# EAGLE design ear-o_devboard (EAGLE 8.4.3)
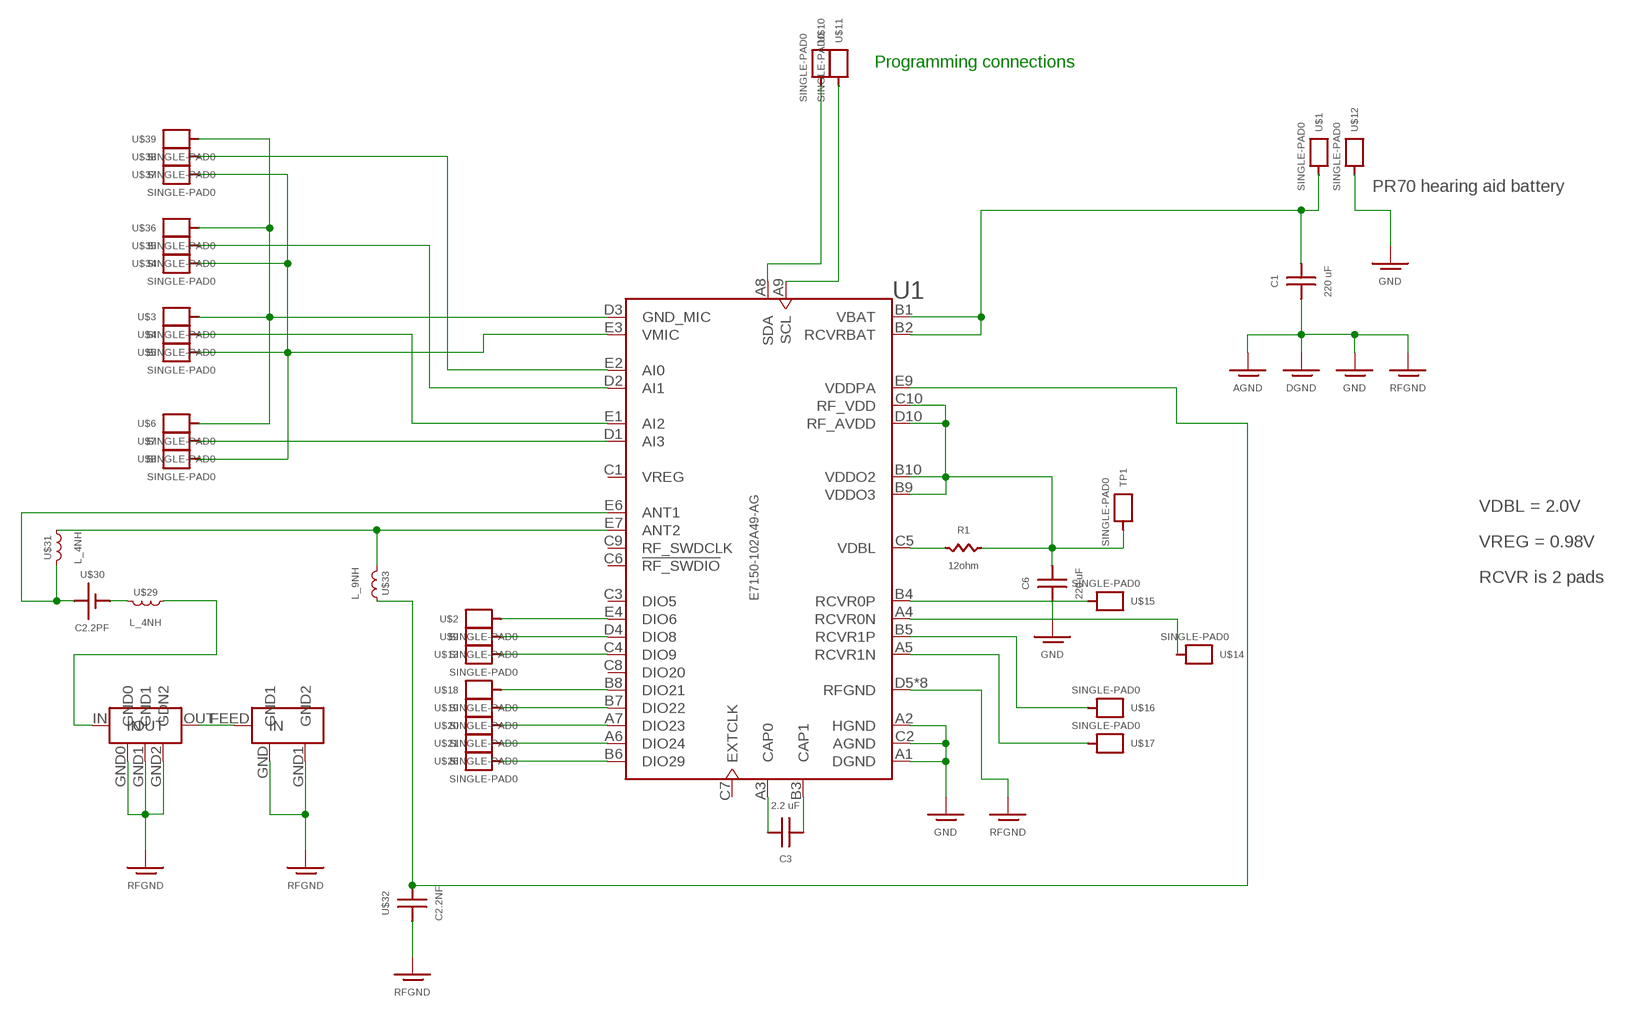
[diagram p0: schematic, sheet 1]

## Parts
C1  220 uF  C220UF  [1206]
C3  2.2 uF  C2.2UF  [0201]
C6  220 uF  C220UF  [1206]
R1  12ohm  R12OHM  [0201]
TP1  SINGLE-PAD0  [TH]
U1  E7150-102A49-AG  [BGA49C69P10X5_739X394X178]
U$1  SINGLE-PAD0  [TH]
U$2  SINGLE-PAD0  [TH]
U$3  SINGLE-PAD0  [TH]
U$4  SINGLE-PAD0  [TH]
U$5  SINGLE-PAD0  [TH]
U$6  SINGLE-PAD0  [TH]
U$7  SINGLE-PAD0  [TH]
U$8  SINGLE-PAD0  [TH]
U$9  SINGLE-PAD0  [TH]
U$10  SINGLE-PAD0  [TH]
U$11  SINGLE-PAD0  [TH]
U$12  SINGLE-PAD0  [TH]
U$13  SINGLE-PAD0  [TH]
U$14  SINGLE-PAD0  [TH]
U$15  SINGLE-PAD0  [TH]
U$16  SINGLE-PAD0  [TH]
U$17  SINGLE-PAD0  [TH]
U$18  SINGLE-PAD0  [TH]
U$19  SINGLE-PAD0  [TH]
U$20  SINGLE-PAD0  [TH]
U$21  SINGLE-PAD0  [TH]
U$26  SINGLE-PAD0  [TH]
U$27  CHIP_ANT  [W3008]
U$28  RF_FILT  [BPFILT]
U$29  L_4NH  [0402]
U$30  C2.2PF  [0201]
U$31  L_4NH  [0402]
U$32  C2.2NF  [0201]
U$33  L_9NH  [0402]
U$34  SINGLE-PAD0  [TH]
U$35  SINGLE-PAD0  [TH]
U$36  SINGLE-PAD0  [TH]
U$37  SINGLE-PAD0  [TH]
U$38  SINGLE-PAD0  [TH]
U$39  SINGLE-PAD0  [TH]

## Nets
1.4V: C1.P$2 U1.B1(VBAT) U1.B2(RCVRBAT) U$1.P$1
DIO6: U1.E4(DIO6) U$2.P$1
DIO8: U1.D4(DIO8) U$9.P$1
DIO9: U1.C4(DIO9) U$13.P$1
DIO21: U1.B8(DIO21) U$18.P$1
DIO22: U1.B7(DIO22) U$19.P$1
DIO23: U1.A7(DIO23) U$20.P$1
DIO24: U1.A6(DIO24) U$21.P$1
DIO29: U1.B6(DIO29) U$26.P$1
MIC0S: U1.E2(AI0) U$38.P$1
MIC1S: U1.D2(AI1) U$35.P$1
MIC2S: U1.E1(AI2) U$4.P$1
MIC3S: U1.D1(AI3) U$7.P$1
MIC-N: U1.D3(GND_MIC) U$3.P$1 U$6.P$1 U$36.P$1 U$39.P$1
MIC-P: U1.E3(VMIC) U$5.P$1 U$8.P$1 U$34.P$1 U$37.P$1
N$3: R1.P$1 U1.C5(VDBL)
N$10: C3.P$2 U1.A3(CAP0)
N$13: C3.P$1 U1.B3(CAP1)
N$16: U$27.FEED(IN) U$28.OUT
N$17: U$28.IN U$29.1
N$18: U1.E9(VDDPA) U$32.P$2 U$33.1
N$19: U1.E7(ANT2) U$31.1 U$33.2
P1.4V: U1.E6(ANT1) U$30.P$2(P1.4V) U$31.2
RCVR0N: U1.A4(RCVR0N) U$14.P$1
RCVR0P: U1.B4(RCVR0P) U$15.P$1
RCVR1N: U1.A5(RCVR1N) U$17.P$1
RCVR1P: U1.B5(RCVR1P) U$16.P$1
RFGND: C1.P$1 C6.P$1 U1.A1(DGND) U1.A2(HGND) U1.C2(AGND) U1.D5(RFGND) U1.D6(RFGND) U1.D7(RFGND) U1.D8(RFGND) U1.D9(RFGND) U1.E5(RFGND) U1.E8(RFGND) U1.E10(RFGND) U$12.P$1 U$27.GND1(GND2) U$27.GND(GND1) U$28.GND0 U$28.GND1 U$28.GND2(GDN2) U$29.2 U$30.P$1(GND) U$32.P$1 ; supply symbol labelled DGND, AGND, GND
SCL: U1.A9(SCL) U$11.P$1
SDA: U1.A8(SDA) U$10.P$1
VDBL: C6.P$2 R1.P$2 TP1.P$1 U1.B9(VDDO3) U1.B10(VDDO2) U1.C10(RF_VDD) U1.D10(RF_AVDD)
Unconnected: U1.C3(DIO5) U1.C6(!RF_SWDIO) U1.C7(EXTCLK) U1.C8(DIO20) U1.C9(RF_SWDCLK)

## Notes on the sheet
- Programming connections
- PR70 hearing aid battery
- VDBL = 2.0V
- VREG = 0.98V
- RCVR is 2 pads

## Power pins joined to a net without a drawn wire
VREG: U1.C1(VREG)

## Library data of the parts
C1 C6 = my-parts-v1:C220UF: digikey pn 490-9774-2-ND package 1206
C3 = my-parts-v1:C2.2UF: digkey pn 490-13224-2-ND 0201 package
R1 = my-parts-v1:R12OHM: dgikey pn P12.0ABTR-ND
TP1 U$1-U$21 U$26 U$34-U$39 = my-parts-v1:SINGLE-PAD
U1 = E7150-102A49-AG:E7150-102A49-AG: Reel / Ezario 7150 Sl; MANUFACTURER: ON Semiconductor
U$27 = my-parts-v1:CHIP_ANT
U$28 = my-parts-v1:RF_FILT
U$29 U$31 = my-parts-v1:L_4NH
U$30 = my-parts-v1:C2.2PF
U$32 = my-parts-v1:C2.2NF
U$33 = my-parts-v1:L_9NH

## Board
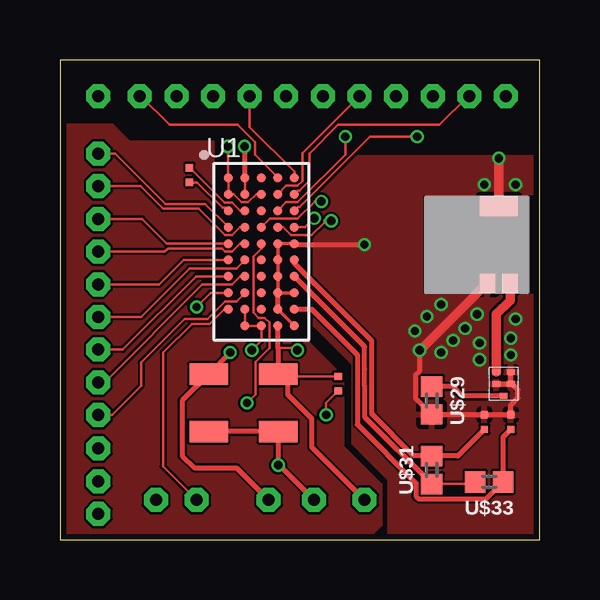
[diagram p1: board, top side]
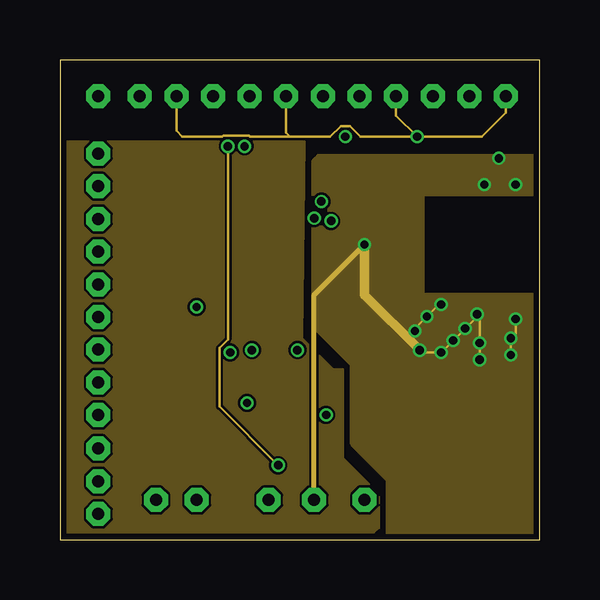
[diagram p2: board, inner layer Route2]
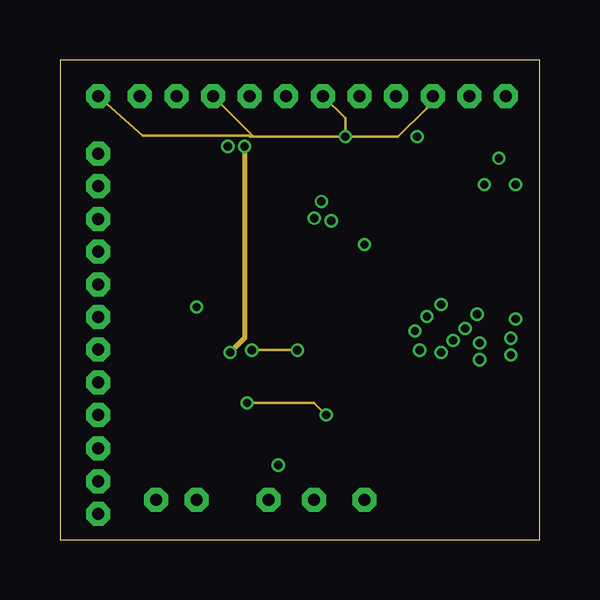
[diagram p3: board, inner layer Route3]
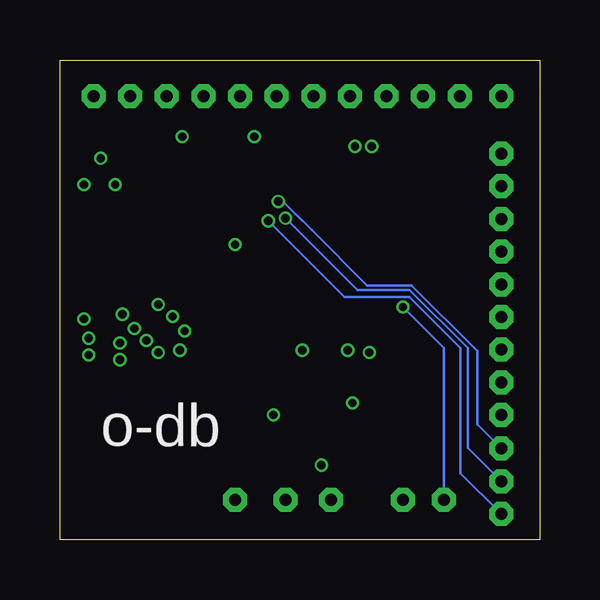
[diagram p4: board, bottom side, seen from below]

Size 20 x 20 mm. Coordinates in mm from the lower left corner, seen from the top.
Outline: 0,0 20,0 20,20 0,20 0,0
Copper layers (1+2*3+16): Top 0.012mm / dielectric 0.36mm / Route2 0.018mm / dielectric 0.71mm / Route3 0.018mm / dielectric 0.36mm / Bottom 0.012mm
Design rules "eC_4Layer_PClass9_BaseCopperO12-I18": minimum track width 0.09mm, minimum drill 0.25mm, track to track 0.1mm, track to pad 0.1mm, pad to pad 0.1mm, via to via 0.1mm, smd to smd 0mil, copper to edge 0.25mm, drill to drill 0.35mm, minimum pad ring 0.15mm, minimum via ring 0.1mm, stop-mask expansion 0mil, vias tented up to drill 0.45mm, thermal gap 0.2mm

### Footprints (pad centres in the part's own frame; a part is rotated, then mirrored left to right if it is on the bottom)
1206 = smd 0.889 x 1.6: P$1 -1.194,0; P$2 1.194,0
0201 = smd 0.305 x 0.305: P$1 0.305,0; P$2 -0.305,0
TH = drill 0.5 pad 1 octagon: P$1 0,0
BGA49C69P10X5_739X394X178 = smd 0.37 x 0.37: A1 -3.087,-1.372; A2 -2.401,-1.372; A3 -1.715,-1.372; A4 -1.029,-1.372; A5 -0.343,-1.372; A6 0.343,-1.372; A7 1.029,-1.372; A8 1.715,-1.372; A9 2.401,-1.372; B1 -3.087,-0.686; B2 -2.401,-0.686; B3 -1.715,-0.686; B4 -1.029,-0.686; B5 -0.343,-0.686; B6 0.343,-0.686; B7 1.029,-0.686; B8 1.715,-0.686; B9 2.401,-0.686; B10 3.087,-0.686; C1 -3.087,0; C2 -2.401,0; C3 -1.715,0; C4 -1.029,0; C5 -0.343,0; C6 0.343,0; C7 1.029,0; C8 1.715,0; C9 2.401,0; C10 3.087,0; D1 -3.087,0.686; D2 -2.401,0.686; D3 -1.715,0.686; D4 -1.029,0.686; D5 -0.343,0.686; D6 0.343,0.686; D7 1.029,0.686; D8 1.715,0.686; D9 2.401,0.686; D10 3.087,0.686; E1 -3.087,1.372; E2 -2.401,1.372; E3 -1.715,1.372; E4 -1.029,1.372; E5 -0.343,1.372; E6 0.343,1.372; E7 1.029,1.372; E8 1.715,1.372; E9 2.401,1.372; E10 3.087,1.372
W3008 = smd 0.8 x 0.65: FEED 3.2,0.475; GND1 3.2,-0.475 | smd 0.8 x 1.6: GND 0,0
BPFILT = smd 0.25 x 0.33: GND0 0.5,0.3; GND1 0.5,-0.3; GND2 1,-0.3; IN 0,0; OUT 1,0.3
0402 = smd 0.85 x 0.9: 1 -0.58,0; 2 0.58,0

### Placement (x,y rotation side)
C1  6.2,5.7 90 top
C3  5.4,15.2 90 top
C6  9.1,5.7 90 top
R1  11.6,6.5 270 top
TP1  12.7,1.65 90 top
U1  8.4,12 270 top
U$1  8.7,1.65 90 top
U$2  1.6,2.43 0 top
U$3  15.55,18.5 270 top
U$4  7.91,18.5 270 top
U$5  18.6,18.5 270 top
U$6  1.6,18.5 270 top
U$7  3.33,18.5 270 top
U$8  4.85,18.5 270 top
U$9  1.6,1.06 0 top
U$10  4,1.65 90 top
U$11  5.7,1.65 90 top
U$12  10.6,1.65 90 top
U$13  1.6,3.8 0 top
U$14  1.6,16.1 180 top
U$15  1.6,14.74 180 top
U$16  1.6,12.01 180 top
U$17  1.6,13.37 180 top
U$18  1.6,5.19 0 top
U$19  1.6,6.55 0 top
U$20  1.6,7.92 0 top
U$21  1.6,10.65 0 top
U$26  1.6,9.28 180 top
U$27  18.3,13.9 270 top
U$28  18.5,6 90 top
U$29  15.5,5.8 270 top
U$30  17.7,4.9 90 top
U$31  15.5,2.9 90 top
U$32  18.8,4.9 90 top
U$33  17.9,2.4 180 top
U$34  9.44,18.5 270 top
U$35  12.49,18.5 270 top
U$36  6.38,18.5 270 top
U$37  14.02,18.5 270 top
U$38  17.07,18.5 270 top
U$39  10.96,18.5 270 top

### Tracks (layer width: path | path; a pad name or v marks a point on that pad's centre or on a via)
1.4V  (via drill 0.35)
  Top 0.1: 7.71,15 U1.B2 | U1.B1 7.71,15 | v7.7,16.4 7.7,15.01 7.71,15
  Top 0.2: v7.1,7.8 C1.P$2 5.1,5.79 5.1,3.5 5.62,2.98 7.37,2.98 U$1.P$1 | v7.7,16.4 7.7,15.1 U1.B1
  Route3 0.2: v7.7,16.4 7.7,8.4 v7.1,7.8
DIO6  (via drill 0.35)
  Top 0.1: U1.E4 10.23,13.03 v10.6,13.4
  Bottom 0.1: v10.6,13.4 7.6,10.4 5.42,10.4 3,7.98 3,3.83 U$2.P$1
DIO8  (via drill 0.35)
  Top 0.1: v11.31,13.29 11.03,13.31 11.03,13.22 10.49,12.69 9.63,12.69 9.3,13.03 U1.D4
  Bottom 0.1: U$9.P$1 3.3,2.76 3.3,8 5.42,10.12 8.14,10.12 v11.31,13.29
DIO9  (via drill 0.35)
  Top 0.1: U1.C4 8.75,13.38 9.91,13.38 10.63,14.1 v10.9,14.1
  Bottom 0.1: 9.5,12.9 7.2,10.6 5.33,10.6 2.6,7.87 2.6,4.8 U$13.P$1 | 9.5,12.9 10.18,13.58 | 10.7,14.1 v10.9,14.1 10.7,14.1 | 10.7,14.1 9.5,12.9
DIO21
  Top 0.1: U1.B8 7.36,9.93 6.89,9.93 6.16,9.2 5.2,9.2 3.38,7.38 3.38,6.4 2.18,5.19 U$18.P$1
DIO22
  Top 0.1: U1.B7 7.5,10.97 7.17,10.64 5.94,10.64 1.85,6.55 U$19.P$1
DIO23
  Top 0.1: U1.A7 5.67,10.97 2.62,7.92 U$20.P$1
DIO24
  Top 0.1: U1.A6 5.16,11.66 4.14,10.64 U$21.P$1
DIO29
  Top 0.1: U1.B6 7.36,11.31 5.41,11.31 3.38,9.28 U$26.P$1
GND
  pour Route2: 0.1,16.6 10.2,16.6 10.1,8.4 11.4,7.1 11.8,7.1 11.8,3.4 13.3,1.9 13.3,0.5 13.1,0.3 0.3,0.3 0,0.6
MIC0S
  Top 0.1: U1.E2 9.92,14.55 9.99,14.55 10.4,14.96 10.4,16.1 11.6,17.3 15.82,17.3 17.02,18.5 U$38.P$1
MIC1S
  Top 0.1: U$35.P$1 10.11,16.12 10.11,14.95 9.91,14.75 9.44,14.75 U1.D2
MIC2S
  Top 0.1: U$4.P$1 7.91,17.2 9.77,15.34 U1.E1
MIC3S
  Top 0.1: U$7.P$1 3.38,18.5 4.58,17.3 7.4,17.3 8.12,16.58 8.12,16.05 U1.D1
MIC-N  (via drill 0.35)
  Top 0.1: U1.D3 9.44,14.07 9.91,14.07 11.9,16.05 v11.9,16.8
  Route3 0.1: v11.9,16.8 11.9,17.56 U$39.P$1 | v11.9,16.8 7.94,16.8 7.89,16.85 3.45,16.85 U$6.P$1 | v11.9,16.8 8.08,16.8 U$36.P$1 | v11.9,16.8 14.1,16.8 15.3,18 15.3,18.25 U$3.P$1
MIC-P  (via drill 0.35)
  Top 0.1: U1.E3 9.92,13.87 9.99,13.87 12.93,16.8 v14.9,16.8
  Route2 0.1: v14.9,16.8 14.02,17.68 U$37.P$1 | v14.9,16.8 12.54,16.8 12.09,17.25 11.71,17.25 11.26,16.8 9.6,16.8 | 9.6,16.8 9.44,16.96 U$34.P$1 | 9.6,16.8 7.94,16.8 7.89,16.85 6.81,16.85 6.76,16.8 5.1,16.8 4.86,17.05 U$8.P$1 | v14.9,16.8 17.6,16.8 18.6,17.8 U$5.P$1
N$1
  pour Top: 12.8,0 13.4,0.6 13.4,2.3 11.8,3.9 11.8,6.8 10.4,8.2 6.4,8.2 6.4,16.6 2.9,16.6 2.2,17.3 0.3,17.3 0.3,0.2 12.6,0.2
N$3  (via drill 0.35)
  Top 0.1: U1.C5 8.4,12.13 8.06,11.8 8.06,9.46 8.28,9.25 8.54,9.25 8.73,9.05 8.73,7.99 8.15,7.4 8.15,6.05 v7.8,5.7 | v11.1,5.2 11.1,5.7 R1.P$1
  Route3 0.1: v7.8,5.7 10.6,5.7 v11.1,5.2
N$10
  Top 0.1: U1.A3 6.89,13.85 6.77,13.85 5.73,14.89 C3.P$2
N$13
  Top 0.1: C3.P$1 6.86,14.05 7.17,14.05 7.5,13.71 U1.B3
N$16
  Top 0.4: U$28.OUT 18.2,9.4 18.77,9.97 U$27.FEED
N$17
  Top 0.2: U$29.1 16.4,6.38 16.78,6 U$28.IN
N$18
  Top 0.2: U$32.P$2 18.48,4.28 U$33.1 17.77,1.7 14.97,1.7 14.85,1.81 14.85,2.35 12.4,4.8 12.4,7.7 10.5,9.6 U1.E9
N$19
  Top 0.1: U$33.2 17.24,2.32 U$31.1
  Top 0.2: 12.7,6.4 12.7,5.12 U$31.1 | 12.7,6.4 12.7,7.1 | 12.7,6.4 12.7,8.04 U1.E7
P1.4V
  Top 0.2: 16.07,3.5 16.6,3.5 U$30.P$2 16.59,3.48 U$31.2 15.48,3.5 14.74,3.5 13,5.24 13,8.29 9.77,11.52 U1.E6
RCVR0N
  Top 0.1: U1.A4 6.06,14 4.4,14 2.3,16.1 U$14.P$1
RCVR0P
  Top 0.1: U1.B4 7.5,13.03 7.17,12.69 6.89,12.69 5.78,13.8 4.3,13.8 3.36,14.74 U$15.P$1
RCVR1N
  Top 0.1: U1.A5 4.46,12.34 3.43,13.37 U$17.P$1
RCVR1P
  Top 0.1: U1.B5 7.5,12.34 7.17,12.01 6.89,12.01 6.75,12.14 4.5,12.14 4.37,12.01 U$16.P$1
RFGND  (via drill 0.35)
  Top 0.1: 17.68,5.22 U$30.P$1 | 18.83,6.51 U$28.GND1 | v7,16.4 7,15.12 U1.A1 U1.A2 7.24,14.4 7.58,14.07 7.85,14.07 8.19,14.4 U1.C2 | v9.1,3.1 C6.P$1
  Top 0.152: U1.E8 U1.D8 U1.D7 U1.D6 U1.D5 U1.E5 | U1.E10 U1.D9
  Top 0.2: C1.P$1 C6.P$1 9.1,3.15 U$12.P$1 | U1.D9 U1.D8 | U$28.GND2 U$28.GND1 U$28.GND0 | 18.83,6.51 19.1,6.24 19.1,5.9 18.8,5.6 U$32.P$1 U$30.P$1 15.52,5.21 U$29.2 14.85,5.87 14.85,6.89 15,7.04 v15,7.9 | U1.E5 9.81,12.3 v12.7,12.3
  Top 0.4: U$27.GND v18.3,15.9 | U$27.GND1 15.03,7.9 v15,7.9
  Route2 0.1: v18.8,7.7 v18.8,8.4 19,8.6 v19,9.2 | v17.5,7.5 v17.5,8.2 17.5,9.3 v17.4,9.4 17.4,9.3 v16.9,8.8 v16.4,8.3 v15.9,7.8 15.1,7.8 v15,7.9 | v14.8,8.7 14.8,8.8 v15.3,9.3 15.8,9.8 v15.9,9.8 | v7,16.4 7,8.34 6.65,7.99 6.65,5.55 v9.1,3.1
  Route2 0.2: U$12.P$1 10.6,10.2 v12.7,12.3
  Route2 0.4: v15,7.9 12.7,10.2 v12.7,12.3
  other vias: 17.7,14.8 19,14.8
  pour Route2: 10.8,16 20,16 20,14.4 15.1,14.4 15.1,10.2 20,10.2 20,0 13.7,0 13.7,2.5 12.2,4 12.2,7.3 10.6,8.9 10.6,15.8
  pour Top: 10.8,16 20,16 20,14.4 15.1,14.4 15.1,10.2 20,10.2 20,0 13.7,0 13.7,2.5 12.2,4 12.2,7.3 10.6,8.9 10.6,15.8
SCL
  Top 0.1: U1.A9 6.84,9.6 6.24,9 5.5,9 4.3,7.8 4.3,3.05 U$11.P$1
SDA  (via drill 0.35)
  Top 0.1: v5.7,9.7 6.29,10.29 U1.A8
  Bottom 0.1: U$10.P$1 4,8 v5.7,9.7
VDBL  (via drill 0.35)
  Top 0.1: U1.B9 U1.B10 U1.C10 8.4,8.3 v8,7.9 | C6.P$2 9.19,6.8 R1.P$2 | v9.9,7.9 9.8,8 9.09,8
  Top 0.2: 9.5,6.7 9.5,6.03 10.5,5.03 10.5,3.85 TP1.P$1 | 9.5,6.7 C6.P$2 | U1.D10 9.09,8 9.09,7.11 9.5,6.7
  Route3 0.1: v8,7.9 v9.9,7.9

### Text on the board
bNames: db-o